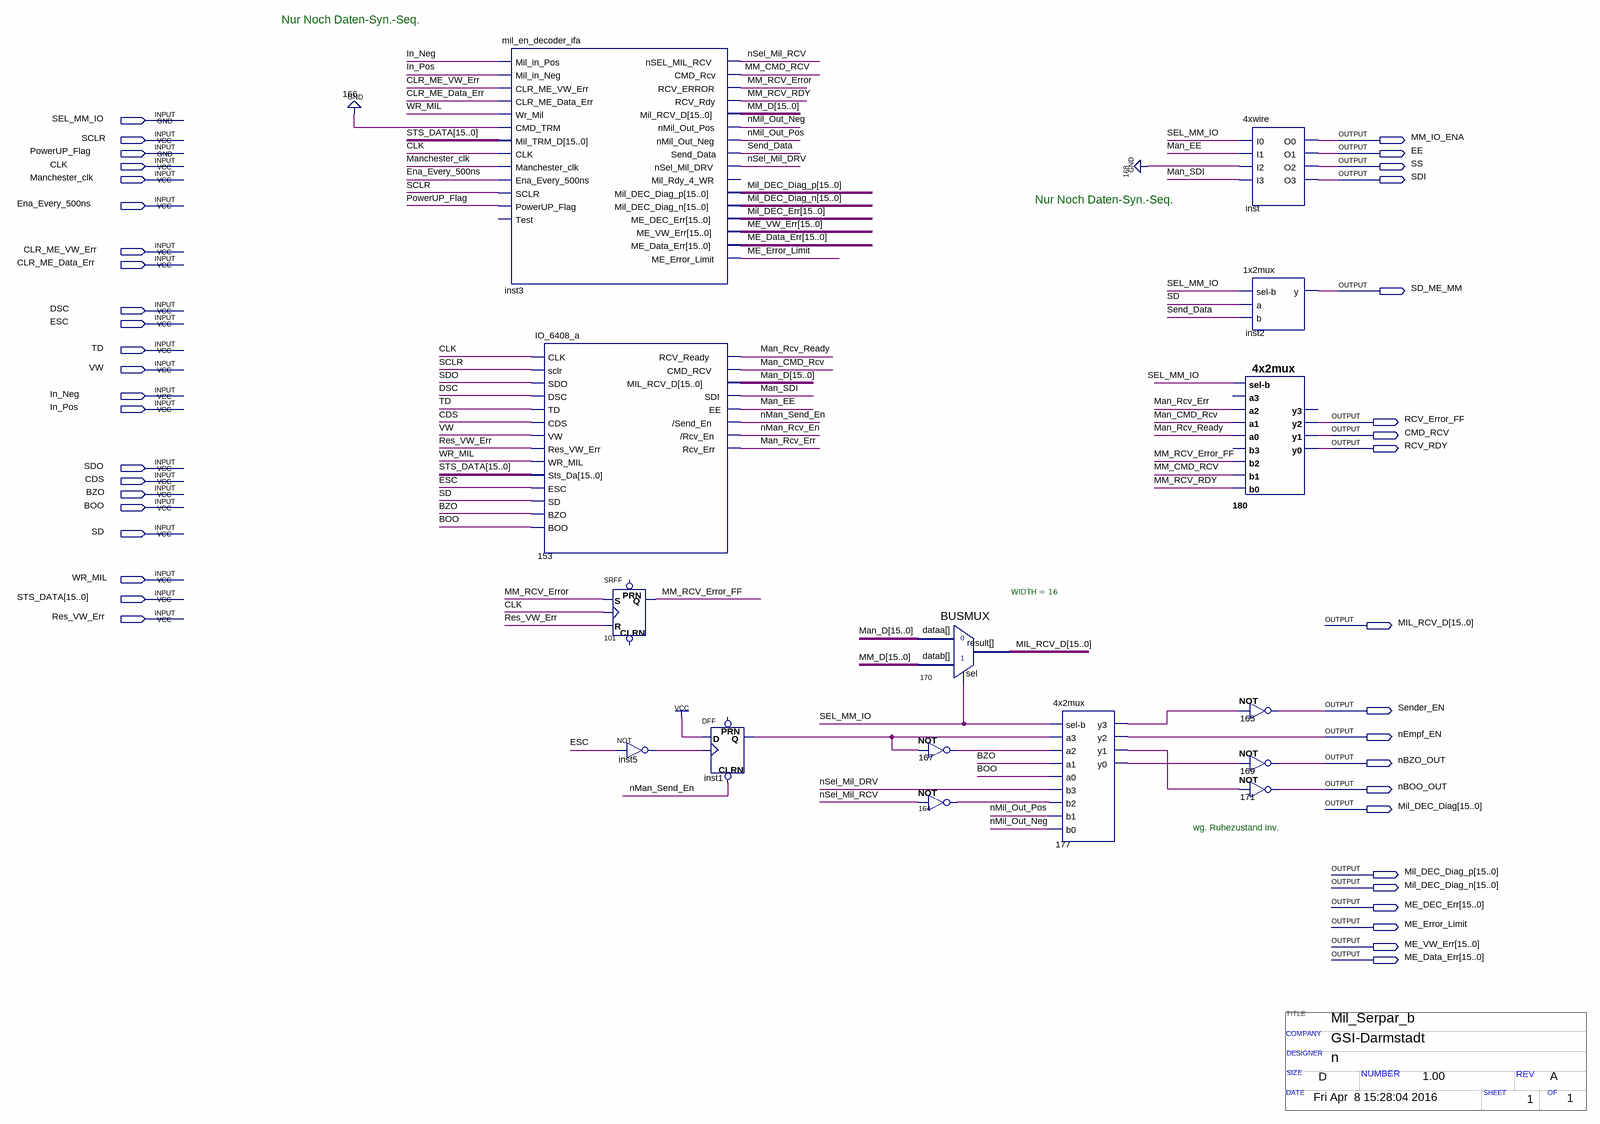
[diagram p0: schematic sheet]
// Quartus schematic mil_serpar_b.bdf as structural Verilog: 15 symbols, 42 pins
// Title block: TITLE: Mil_Serpar_b; COMPANY: GSI-Darmstadt; DESIGNER: n; SIZE: D; NUMBER: 1.00; REV: A; DATE: Fri Apr  8 15:28:04 2016; SHEET: 1; OF: 1
module mil_serpar_b (
  input  SEL_MM_IO,
  input  SCLR,
  input  PowerUP_Flag,
  input  CLK,
  input  Manchester_clk,
  input  Ena_Every_500ns,
  input  CLR_ME_VW_Err,
  input  CLR_ME_Data_Err,
  input  DSC,
  input  ESC,
  input  TD,
  input  VW,
  input  In_Neg,
  input  In_Pos,
  input  SDO,
  input  CDS,
  input  BZO,
  input  BOO,
  input  SD,
  input  WR_MIL,
  input  [15:0] STS_DATA,
  input  Res_VW_Err,
  output MM_IO_ENA,
  output EE,
  output SS,
  output SDI,
  output SD_ME_MM,
  output RCV_Error_FF,
  output CMD_RCV,
  output RCV_RDY,
  output [15:0] MIL_RCV_D,
  output Sender_EN,
  output nEmpf_EN,
  output nBZO_OUT,
  output nBOO_OUT,
  output [15:0] Mil_DEC_Diag,
  output [15:0] Mil_DEC_Diag_p,
  output [15:0] Mil_DEC_Diag_n,
  output [15:0] ME_DEC_Err,
  output ME_Error_Limit,
  output [15:0] ME_VW_Err,
  output [15:0] ME_Data_Err
);

  wire inst1_q, inst5_out, Man_CMD_Rcv, Man_EE, Man_Rcv_Err, Man_Rcv_Ready, Man_SDI, MM_CMD_RCV,
       MM_RCV_Error, MM_RCV_Error_FF, MM_RCV_RDY, n164_out, n167_out, n177_y0, n177_y1, n177_y3, nMan_Rcv_En,
       nMan_Send_En, nMil_Out_Neg, nMil_Out_Pos, nSel_Mil_DRV, nSel_Mil_RCV, Send_Data;
  wire [15:0] Man_D, Mil_DEC_Err, MM_D;

  mil_en_decoder_ifa inst3 (
    .Mil_in_Pos(In_Neg), .Mil_in_Neg(In_Pos), .CLR_ME_VW_Err(CLR_ME_VW_Err),
    .CLR_ME_Data_Err(CLR_ME_Data_Err), .Wr_Mil(WR_MIL), .CMD_TRM(1'b0), .Mil_TRM_D(STS_DATA), .CLK(CLK),
    .Manchester_clk(Manchester_clk), .Ena_Every_500ns(Ena_Every_500ns), .SCLR(SCLR),
    .PowerUP_Flag(PowerUP_Flag), .nSEL_MIL_RCV(nSel_Mil_RCV), .CMD_Rcv(MM_CMD_RCV), .RCV_ERROR(MM_RCV_Error),
    .RCV_Rdy(MM_RCV_RDY), .Mil_RCV_D(MM_D), .nMil_Out_Pos(nMil_Out_Neg), .nMil_Out_Neg(nMil_Out_Pos),
    .Send_Data(Send_Data), .nSel_Mil_DRV(nSel_Mil_DRV), .Mil_DEC_Diag_p(Mil_DEC_Diag_p),
    .Mil_DEC_Diag_n(Mil_DEC_Diag_n), .ME_DEC_Err(Mil_DEC_Err), .ME_VW_Err(ME_VW_Err),
    .ME_Data_Err(ME_Data_Err), .ME_Error_Limit(ME_Error_Limit));  // open: Test, Mil_Rdy_4_WR
  IO_6408_a u_153 (
    .CLK(CLK), .sclr(SCLR), .SDO(SDO), .DSC(DSC), .TD(TD), .CDS(CDS), .VW(VW), .Res_VW_Err(Res_VW_Err),
    .WR_MIL(WR_MIL), .Sts_Da(STS_DATA), .ESC(ESC), .SD(SD), .BZO(BZO), .BOO(BOO), .RCV_Ready(Man_Rcv_Ready),
    .CMD_RCV(Man_CMD_Rcv), .MIL_RCV_D(Man_D), .SDI(Man_SDI), .EE(Man_EE), .\/Send_En (nMan_Send_En),
    .\/Rcv_En (nMan_Rcv_En), .Rcv_Err(Man_Rcv_Err));
  SRFF u_101 (.S(MM_RCV_Error), .R(Res_VW_Err), .CLK(CLK), .Q(MM_RCV_Error_FF));  // open: PRN, CLRN
  not inst5 (inst5_out, ESC);
  DFF inst1 (.CLRN(nMan_Send_En), .CLK(inst5_out), .D(1'b1), .Q(inst1_q));  // open: PRN
  BUSMUX #(.WIDTH(16)) u_170 (.datab(MM_D), .sel(SEL_MM_IO), .dataa(Man_D), .result(MIL_RCV_D));
  not u_167 (n167_out, inst1_q);
  not u_164 (n164_out, nSel_Mil_RCV);
  \4x2mux  u_177 (
    .\sel-b (SEL_MM_IO), .a3(inst1_q), .a2(n167_out), .a1(BZO), .a0(BOO), .b3(nSel_Mil_DRV), .b2(n164_out),
    .b1(nMil_Out_Pos), .b0(nMil_Out_Neg), .y3(n177_y3), .y2(nEmpf_EN), .y1(n177_y1), .y0(n177_y0));
  \4xwire  inst (.I0(SEL_MM_IO), .I1(Man_EE), .I2(1'b0), .I3(Man_SDI), .O0(MM_IO_ENA), .O1(EE), .O2(SS), .O3(SDI));
  \1x2mux  inst2 (.\sel-b (SEL_MM_IO), .a(SD), .b(Send_Data), .y(SD_ME_MM));
  \4x2mux  u_180 (
    .\sel-b (SEL_MM_IO), .a2(Man_Rcv_Err), .a1(Man_CMD_Rcv), .a0(Man_Rcv_Ready), .b2(MM_RCV_Error_FF),
    .b1(MM_CMD_RCV), .b0(MM_RCV_RDY), .y2(RCV_Error_FF), .y1(CMD_RCV), .y0(RCV_RDY));  // open: a3, b3, y3
  not u_165 (Sender_EN, n177_y3);
  not u_169 (nBZO_OUT, n177_y0);
  not u_171 (nBOO_OUT, n177_y1);

  // Notes on the sheet:
  //   Nur Noch Daten-Syn.-Seq.
  //   Nur Noch Daten-Syn.-Seq.
  //   wg. Ruhezustand inv.
endmodule
